# Altium schematic sheet [2]-Input.SchDoc
size A4
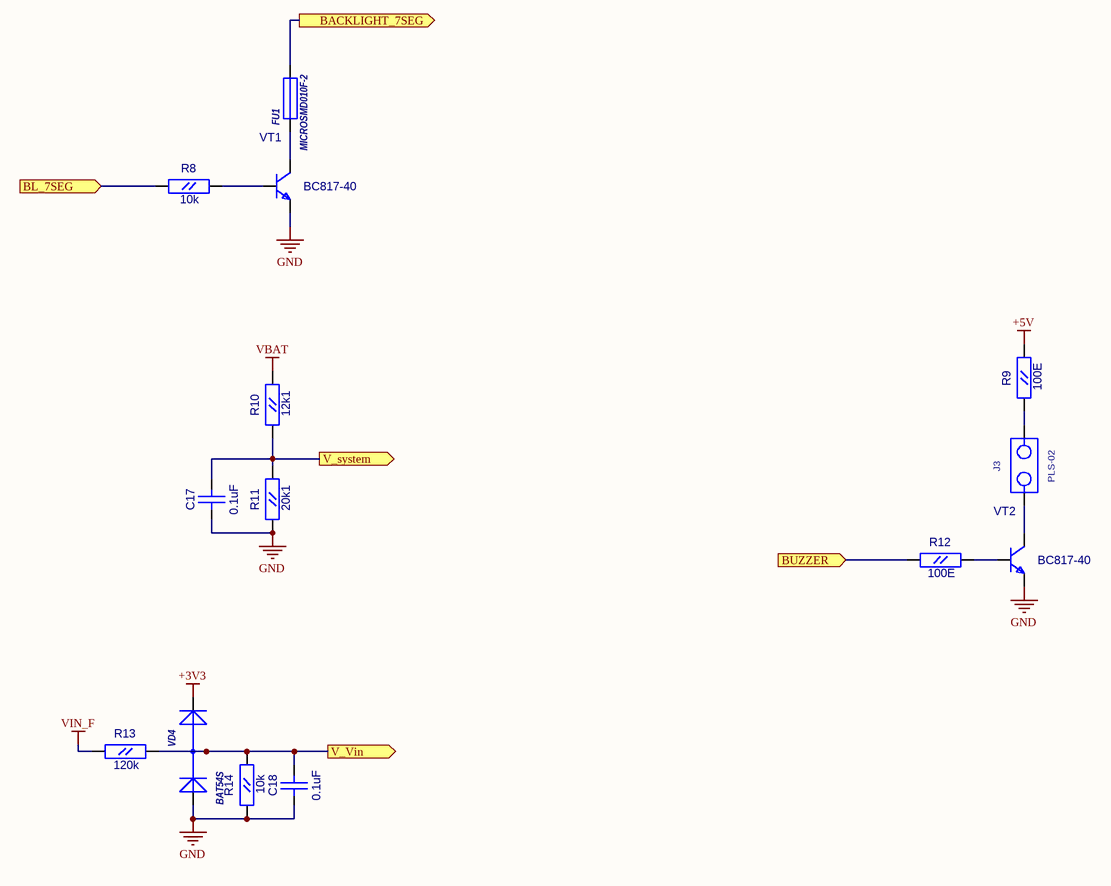
[diagram p0: [2]-Input.SchDoc]

## Parts
C17  0.1uF  [CC0603]
C18  0.1uF  [CC0603]
FU1  MICROSMD010F-2  [RC1210]
J3  PLS-02  [PLS-02]
R8  10k  [RC0603]
R9  100E  [RC0603]
R10  12k1  [RC0603]
R11  20k1  [RC0603]
R12  100E  [RC0603]
R13  120k  [RC0603]
R14  10k  [RC0603]
VD4  BAT54S  [SOT-23(GSD)]
VT1  BC817-40  [SOT-23(123)]
VT2  BC817-40  [SOT-23(123)]

## Ports
BACKLIGHT_7SEG (out), BL_7SEG (in), BUZZER (in), V_system (out), V_Vin (out)

## Nets
+3V3: VD4.2(K)
+5V: R9.2(B)
GND: C17.1(A) C18.1(A) R11.1(A) R14.1(A) VD4.1(A) VT1.2(E) VT2.2(E)
VBAT: R10.2(B)
VIN_F: R13.1(A)
BACKLIGHT_7SEG: FU1.2 ; port BACKLIGHT_7SEG
BL_7SEG: R8.1(A) ; port BL_7SEG
BUZZER: R12.1(A) ; port BUZZER
V_system: C17.2(B) R10.1(A) R11.2(B) ; port V_system
V_Vin: C18.2(B) R13.2(B) R14.2(B) VD4.3(AK) ; port V_Vin
NetFU1_1: FU1.1 VT1.3(C)
NetJ3_1: J3.1 VT2.3(C)
NetJ3_2: J3.2 R9.1(A)
NetR8_2: R8.2(B) VT1.1(B)
NetR12_2: R12.2(B) VT2.1(B)

## Library data of the parts
C17 C18 = CC0603: Value: 0.1uF
FU1 = MICROSMD: Value: MICROSMD010F-2
R8-R14 = RC0603
  R8 R14: Value: 10k
  R9 R12: Value: 100E
  R10: Value: 12k1
  R11: Value: 20k1
  R13: Value: 120k
VD4 = BAT54S: 1.0 Ampere General Purpose Rectifier; ComponentField6: Published 8-Jun-2000, Modified 11-July-2000: SIM Model Added.; Value: *
VT1 VT2 = BC846BLT1: NPN 500ma transistor; ComponentField7: Published 29-Sep-2000; OriginalName: BC846BLT1; Value: BC817-40
J3 = PLS-02: Value: *